# EAGLE design 00A-34 (EAGLE 6.3)
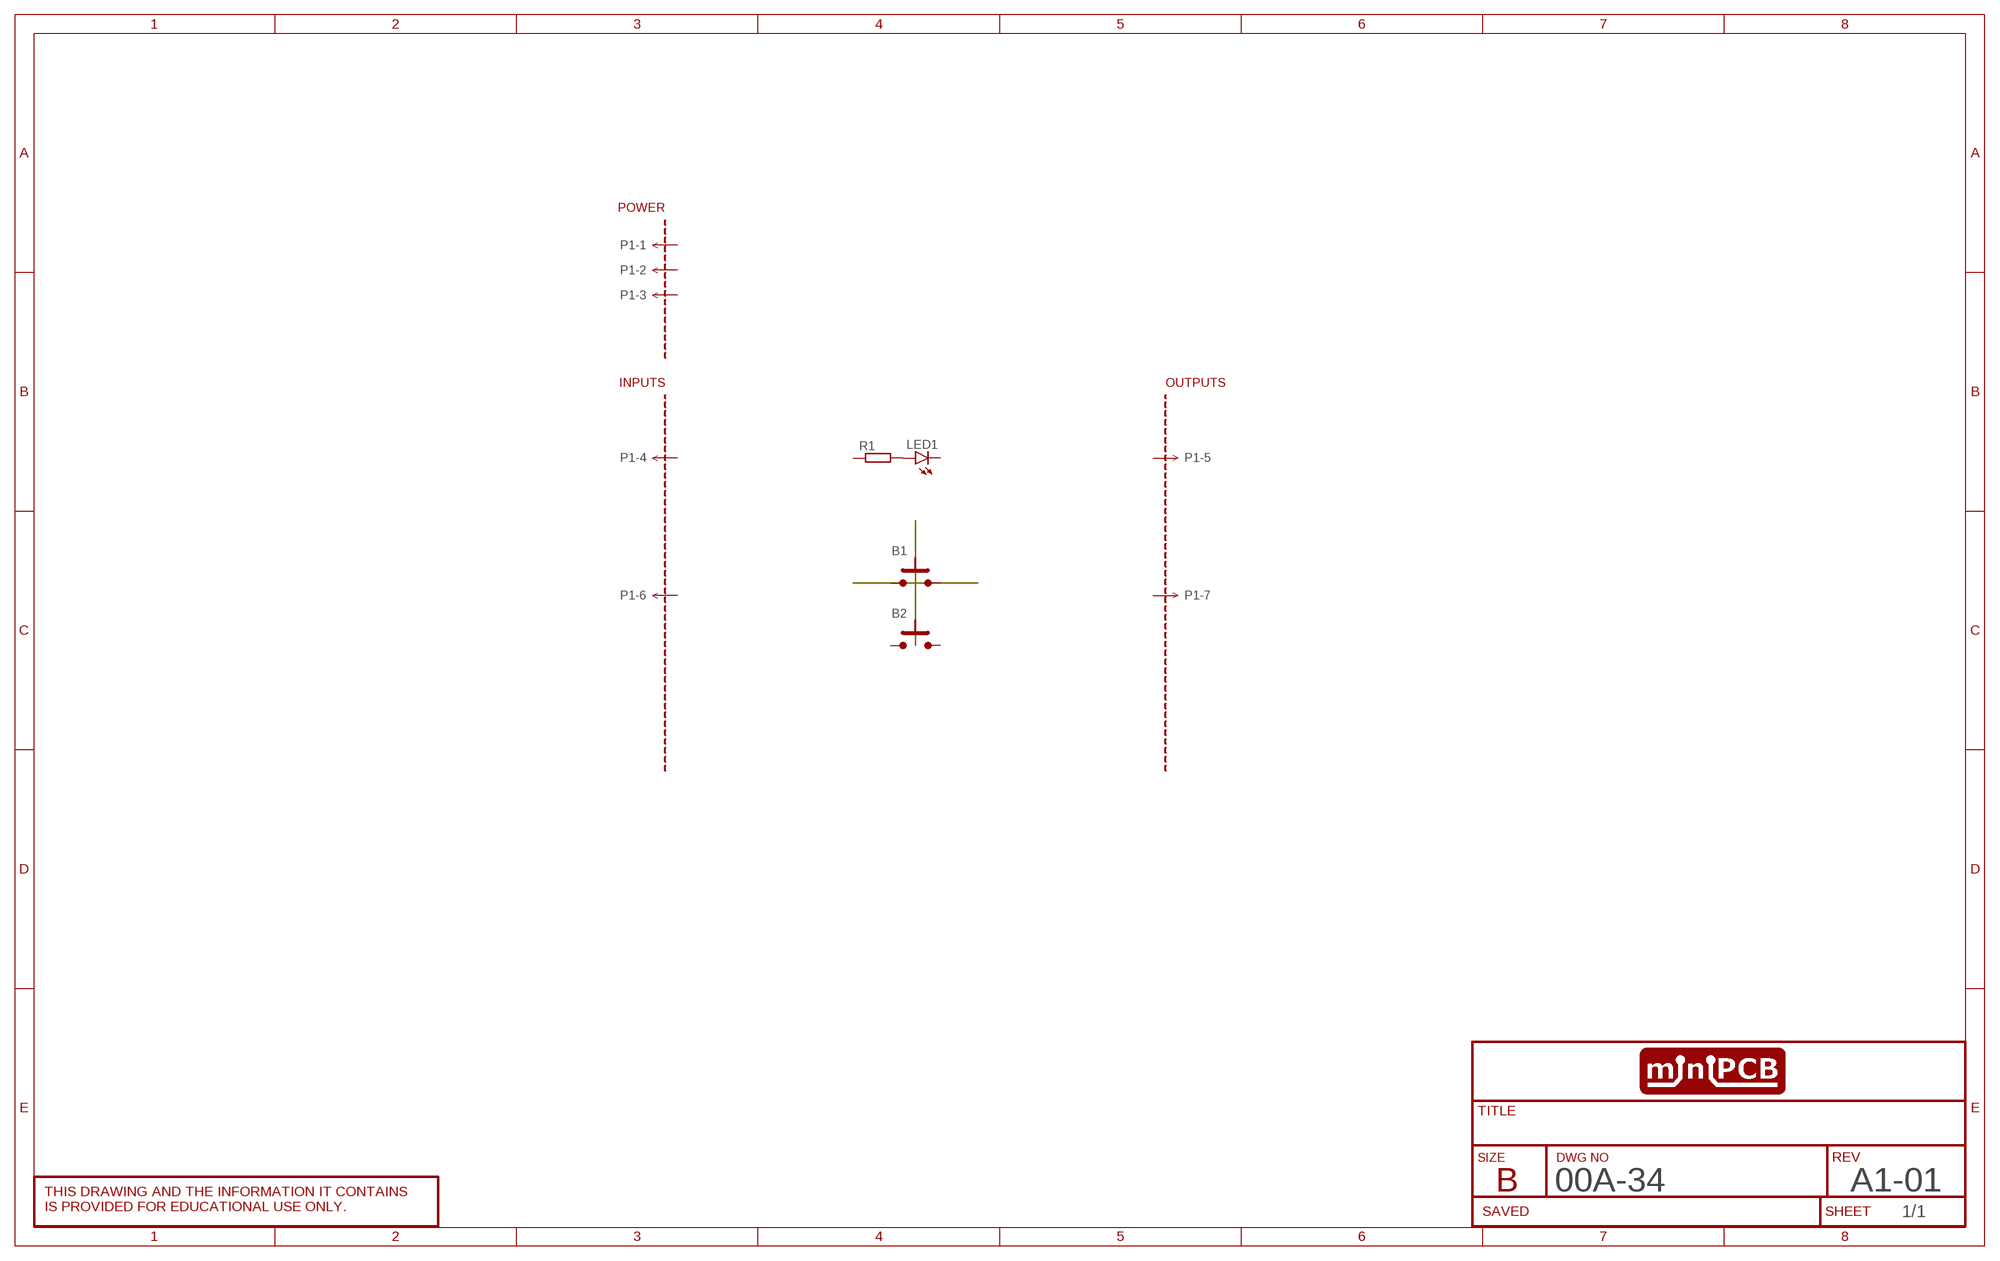
[diagram p0: schematic, sheet 1]
SHEET1 (SCHEMATIC): REV: A1-01

## Parts
B1  PUSHBUTTON6X6MM  [6X6MM]
B2  PUSHBUTTON6X6MM  [6X6MM]
LED1  LED5MM  [LED5MM]
P1  MINIPCB_7P  [PINS_1X7]
PCB1  MINIPCB_0P50X50  [MINIPCB_0P_50X50MM]
R1  RESISTORSMD  [R0805]

## Nets
N$239: LED1.A R1.2
Unconnected: B1.1.A B1.2.A B1.3.B B1.4.B B2.1.A B2.2.A B2.3.B B2.4.B LED1.K(C) P1.1 P1.2 P1.3 P1.4 P1.5 P1.6 P1.7 R1.1

## Library data of the parts
B1 B2 = minipcb:PUSHBUTTON: Tactile push button switch
LED1 = minipcb:LED: LED OSRAM: - CHIPLED LG R971, LG N971, LY N971, LG Q971, LY Q971, LO R971, LY R971 LH N974, LH R974 LS Q976, LO Q976, LY Q976 LO Q996 - Hyper CHIPLED LW Q18S LB Q993, LB Q99A, LB R99A - SideLED LS A670, LO A670, LY A670, LG A670, LP A670 LB A673, LV A673, LT A673, LW A673 LH A674 LY A675 LS A676, LA A676, LO A676, LY A676, LW A676 LS A679, LY A679, LG A679 - Hyper Micro SIDELED® LS Y876, LA Y876, LO Y876, LY Y876 LT Y87S - SmartLED LW L88C, LW L88S LB L89C, LB L89S, LG L890 LS L89K, LO L89K, LY L89K LS L896, LA L896, LO L896, LY L896 - TOPLED LS T670, LO T670, LY T670, LG T670, LP T670 LSG T670, LSP T670, LSY T670, LOP T670, LYG T670 LG T671, LOG T671, LSG T671 LB T673, LV T673, LT T673, LW T673 LH T674 LS T676, LA T676, LO T676, LY T676, LB T676, LH T676, LSB T676, LW T676 LB T67C, LV T67C, LT T67C, LS T67K, LO T67K, LY T67K, LW E67C LS E67B, LA E67B, LO E67B, LY E67B, LB E67C, LV E67C, LT E67C LW T67C LS T679, LY T679, LG T679 LS T770, LO T770, LY T770, LG T770, LP T770 LB T773, LV T773, LT T773, LW T773 LH T774 LS E675, LA E675, LY E675, LS T675 LS T776, LA T776, LO T776, LY T776, LB T776 LHGB T686 LT T68C, LB T68C - Hyper Mini TOPLED® LB M676 - Mini TOPLED Santana® LG M470 LS M47K, LO M47K, LY M47K Source: http://www.osram.convergy.de LUXEON: - LUMILED® LXK2-PW12-R00, LXK2-PW12-S00, LXK2-PW14-U00, LXK2-PW14-V00 LXK2-PM12-R00, LXK2-PM12-S00, LXK2-PM14-U00 LXK2-PE12-Q00, LXK2-PE12-R00, LXK2-PE12-S00, LXK2-PE14-T00, LXK2-PE14-U00 LXK2-PB12-K00, LXK2-PB12-L00, LXK2-PB12-M00, LXK2-PB14-N00, LXK2-PB14-P00, LXK2-PB14-Q00 LXK2-PR12-L00, LXK2-PR12-M00, LXK2-PR14-Q00, LXK2-PR14-R00 LXK2-PD12-Q00, LXK2-PD12-R00, LXK2-PD12-S00 LXK2-PH12-R00, LXK2-PH12-S00 LXK2-PL12-P00, LXK2-PL12-Q00, LXK2-PL12-R00 Source: www.luxeon.com KINGBRIGHT: KA-3528ASYC Source: www.kingbright.com
P1 = minipcb:MINIPCB_7P
PCB1 = minipcb:MINIPCB_0P; CIRCUIT_CATEGORY: PROBE AND PROTOTYPING; PART_NUMBER: 00A-34; REVISION: A1-01; TITLE: 50x50mm PROTOBOARD
R1 = minipcb:RESISTOR

## Board
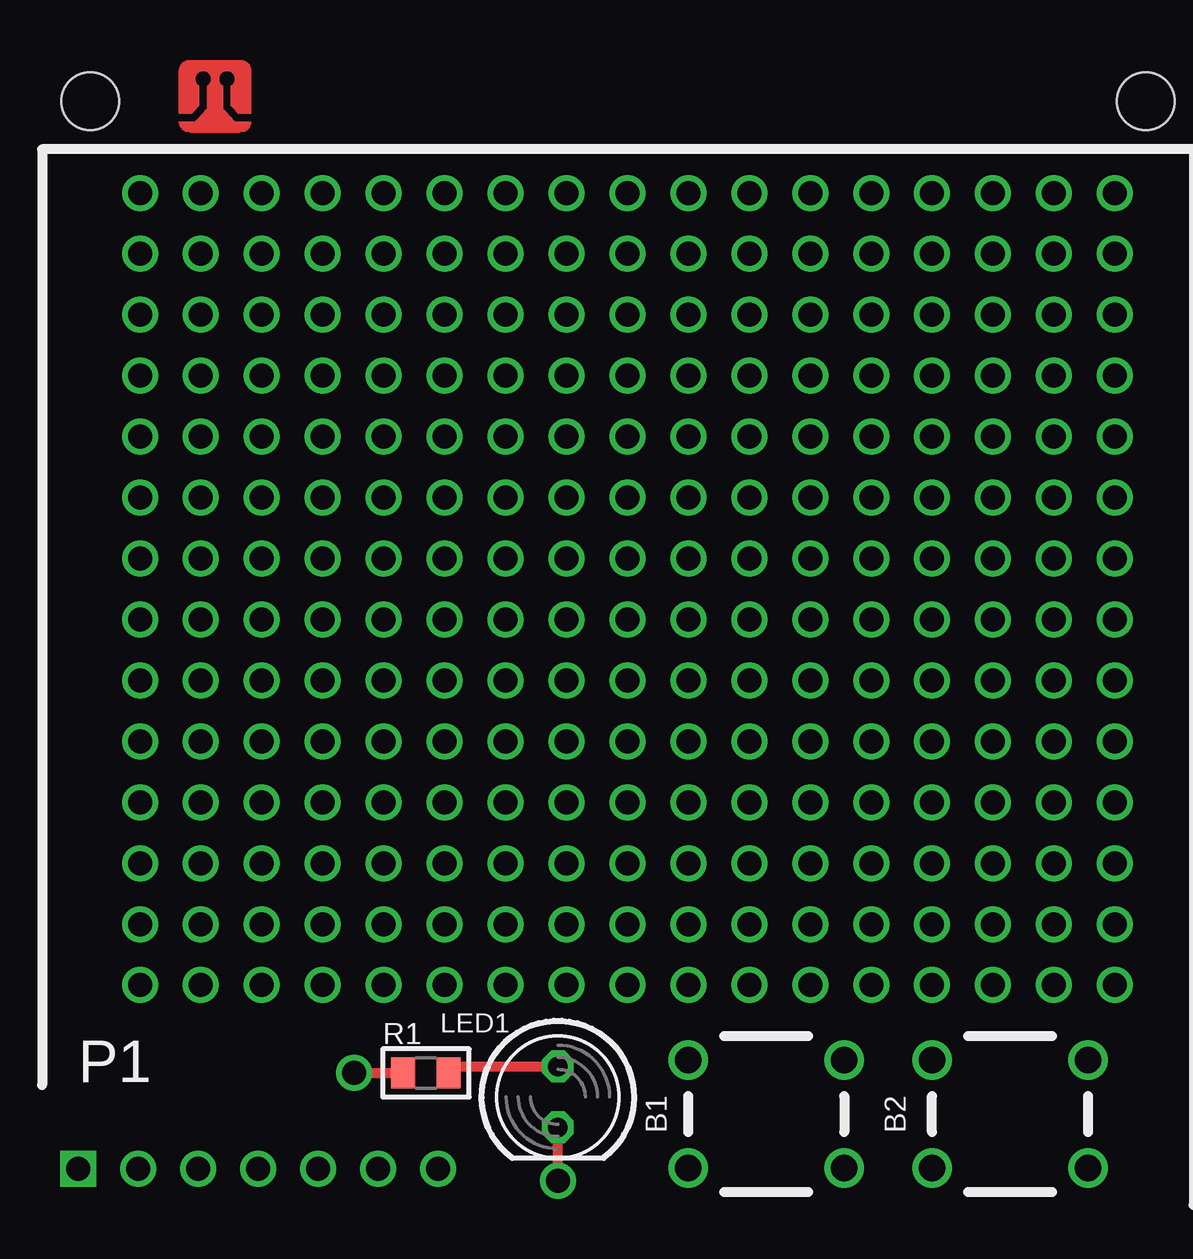
[diagram p1: board, top side]
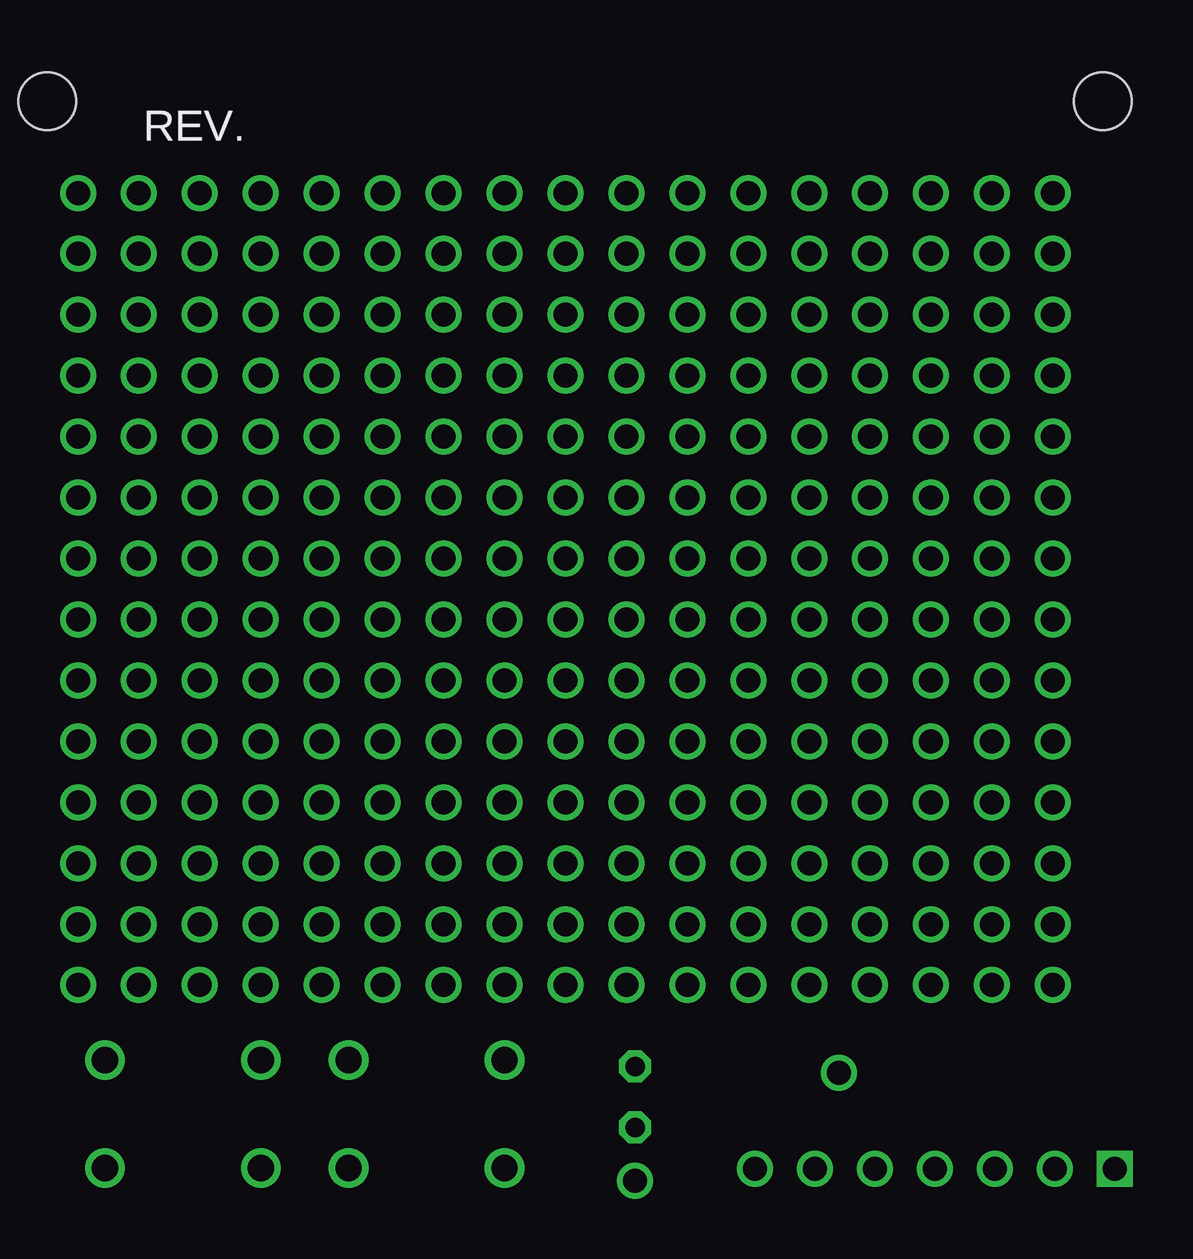
[diagram p2: board, bottom side, seen from below]

No outline drawn. Coordinates in mm, seen from the top.
Copper layers (1*16): Top 0.035mm / dielectric 1.5mm / Bottom 0.035mm
Design rules "default": minimum track width 10mil, minimum drill 0.6mm, track to track 8mil, track to pad 8mil, pad to pad 8mil, via to via 8mil, smd to smd 8mil, copper to edge 40mil, drill to drill 8mil, minimum pad ring 10mil, minimum via ring 8mil, stop-mask expansion 4mil, vias tented up to drill 0mil, thermal gap 10mil

### Footprints (pad centres in the part's own frame; a part is rotated, then mirrored left to right if it is on the bottom)
6X6MM = drill 1.1: 1.A 0,0; 2.A 6.5,0; 3.B 0,4.5; 4.B 6.5,4.5
LED5MM = drill 0.813 octagon: A -1.27,0; K 1.27,0
PINS_1X7 = drill 1 square: 1 0,0 | drill 1: 2 2.5,0; 3 5,0; 4 7.5,0; 5 10,0; 6 12.5,0; 7 15,0
MINIPCB_0P_50X50MM = hole 2.4: 47,47; 3,47
R0805 = smd 1 x 1.3: 1 -0.95,0; 2 0.95,0

### Placement (x,y rotation side)
B1  27.94,2.54 0 top
B2  38.1,2.54 0 top
LED1  22.5,5.5 270 top
P1  2.5,2.5 0 top
PCB1  0,0 0 top
R1  17,6.5 0 top

### Tracks (layer width: path | path; a pad name or v marks a point on that pad's centre or on a via)
N$1  (via drill 1)
  other vias: 5.08,10.16
N$2  (via drill 1)
  other vias: 5.08,12.7
N$3  (via drill 1)
  other vias: 7.62,10.16
N$4  (via drill 1)
  other vias: 10.16,10.16
N$5  (via drill 1)
  other vias: 7.62,12.7
N$6  (via drill 1)
  other vias: 10.16,12.7
N$7  (via drill 1)
  other vias: 12.7,12.7
N$8  (via drill 1)
  other vias: 12.7,10.16
N$9  (via drill 1)
  Top 0.406: v22.5,2 22.5,4 | v14,6.5 16,6.5
  other vias: 15.24,10.16
N$10  (via drill 1)
  other vias: 15.24,12.7
N$11  (via drill 1)
  other vias: 20.32,12.7
N$12  (via drill 1)
  other vias: 17.78,12.7
N$13  (via drill 1)
  other vias: 17.78,10.16
N$14  (via drill 1)
  other vias: 20.32,10.16
N$15  (via drill 1)
  other vias: 22.86,12.7
N$16  (via drill 1)
  other vias: 22.86,10.16
N$17  (via drill 1)
  other vias: 25.4,12.7
N$18  (via drill 1)
  other vias: 25.4,10.16
N$19  (via drill 1)
  other vias: 27.94,12.7
N$20  (via drill 1)
  other vias: 27.94,10.16
N$21  (via drill 1)
  other vias: 30.48,12.7
N$22  (via drill 1)
  other vias: 30.48,10.16
N$23  (via drill 1)
  other vias: 33.02,12.7
N$24  (via drill 1)
  other vias: 33.02,10.16
N$25  (via drill 1)
  other vias: 35.56,12.7
N$26  (via drill 1)
  other vias: 38.1,10.16
N$27  (via drill 1)
  other vias: 35.56,10.16
N$28  (via drill 1)
  other vias: 38.1,12.7
N$29  (via drill 1)
  other vias: 40.64,12.7
N$30  (via drill 1)
  other vias: 40.64,10.16
N$31  (via drill 1)
  other vias: 43.18,12.7
N$32  (via drill 1)
  other vias: 43.18,10.16
N$33  (via drill 1)
  other vias: 45.72,12.7
N$34  (via drill 1)
  other vias: 45.72,10.16
N$35  (via drill 1)
  other vias: 5.08,15.24
N$36  (via drill 1)
  other vias: 5.08,17.78
N$37  (via drill 1)
  other vias: 7.62,15.24
N$38  (via drill 1)
  other vias: 10.16,15.24
N$39  (via drill 1)
  other vias: 7.62,17.78
N$40  (via drill 1)
  other vias: 10.16,17.78
N$41  (via drill 1)
  other vias: 12.7,17.78
N$42  (via drill 1)
  other vias: 12.7,15.24
N$43  (via drill 1)
  other vias: 15.24,15.24
N$44  (via drill 1)
  other vias: 15.24,17.78
N$45  (via drill 1)
  other vias: 20.32,17.78
N$46  (via drill 1)
  other vias: 17.78,17.78
N$47  (via drill 1)
  other vias: 17.78,15.24
N$48  (via drill 1)
  other vias: 20.32,15.24
N$49  (via drill 1)
  other vias: 22.86,17.78
N$50  (via drill 1)
  other vias: 22.86,15.24
N$51  (via drill 1)
  other vias: 25.4,17.78
N$52  (via drill 1)
  other vias: 25.4,15.24
N$53  (via drill 1)
  other vias: 27.94,17.78
N$54  (via drill 1)
  other vias: 27.94,15.24
N$55  (via drill 1)
  other vias: 30.48,17.78
N$56  (via drill 1)
  other vias: 30.48,15.24
N$57  (via drill 1)
  other vias: 33.02,17.78
N$58  (via drill 1)
  other vias: 33.02,15.24
N$59  (via drill 1)
  other vias: 35.56,17.78
N$60  (via drill 1)
  other vias: 38.1,15.24
N$61  (via drill 1)
  other vias: 35.56,15.24
N$62  (via drill 1)
  other vias: 38.1,17.78
N$63  (via drill 1)
  other vias: 40.64,17.78
N$64  (via drill 1)
  other vias: 40.64,15.24
N$65  (via drill 1)
  other vias: 43.18,17.78
N$66  (via drill 1)
  other vias: 43.18,15.24
N$67  (via drill 1)
  other vias: 45.72,17.78
N$68  (via drill 1)
  other vias: 45.72,15.24
N$69  (via drill 1)
  other vias: 5.08,20.32
N$70  (via drill 1)
  other vias: 5.08,22.86
N$71  (via drill 1)
  other vias: 7.62,20.32
N$72  (via drill 1)
  other vias: 10.16,20.32
N$73  (via drill 1)
  other vias: 7.62,22.86
N$74  (via drill 1)
  other vias: 10.16,22.86
N$75  (via drill 1)
  other vias: 12.7,22.86
N$76  (via drill 1)
  other vias: 12.7,20.32
N$77  (via drill 1)
  other vias: 15.24,20.32
N$78  (via drill 1)
  other vias: 15.24,22.86
N$79  (via drill 1)
  other vias: 20.32,22.86
N$80  (via drill 1)
  other vias: 17.78,22.86
N$81  (via drill 1)
  other vias: 17.78,20.32
N$82  (via drill 1)
  other vias: 20.32,20.32
N$83  (via drill 1)
  other vias: 22.86,22.86
N$84  (via drill 1)
  other vias: 22.86,20.32
N$85  (via drill 1)
  other vias: 25.4,22.86
N$86  (via drill 1)
  other vias: 25.4,20.32
N$87  (via drill 1)
  other vias: 27.94,22.86
N$88  (via drill 1)
  other vias: 27.94,20.32
N$89  (via drill 1)
  other vias: 30.48,22.86
N$90  (via drill 1)
  other vias: 30.48,20.32
N$91  (via drill 1)
  other vias: 33.02,22.86
N$92  (via drill 1)
  other vias: 33.02,20.32
N$93  (via drill 1)
  other vias: 35.56,22.86
N$94  (via drill 1)
  other vias: 38.1,20.32
N$95  (via drill 1)
  other vias: 35.56,20.32
N$96  (via drill 1)
  other vias: 38.1,22.86
N$97  (via drill 1)
  other vias: 40.64,22.86
N$98  (via drill 1)
  other vias: 40.64,20.32
N$99  (via drill 1)
  other vias: 43.18,22.86
N$100  (via drill 1)
  other vias: 43.18,20.32
N$101  (via drill 1)
  other vias: 45.72,22.86
N$102  (via drill 1)
  other vias: 45.72,20.32
N$103  (via drill 1)
  other vias: 5.08,25.4
N$104  (via drill 1)
  other vias: 5.08,27.94
N$105  (via drill 1)
  other vias: 7.62,25.4
N$106  (via drill 1)
  other vias: 10.16,25.4
N$107  (via drill 1)
  other vias: 7.62,27.94
N$108  (via drill 1)
  other vias: 10.16,27.94
N$109  (via drill 1)
  other vias: 12.7,27.94
N$110  (via drill 1)
  other vias: 12.7,25.4
N$111  (via drill 1)
  other vias: 15.24,25.4
N$112  (via drill 1)
  other vias: 15.24,27.94
N$113  (via drill 1)
  other vias: 20.32,27.94
N$114  (via drill 1)
  other vias: 17.78,27.94
N$115  (via drill 1)
  other vias: 17.78,25.4
N$116  (via drill 1)
  other vias: 20.32,25.4
N$117  (via drill 1)
  other vias: 22.86,27.94
N$118  (via drill 1)
  other vias: 22.86,25.4
N$119  (via drill 1)
  other vias: 25.4,27.94
N$120  (via drill 1)
  other vias: 25.4,25.4
N$121  (via drill 1)
  other vias: 27.94,27.94
N$122  (via drill 1)
  other vias: 27.94,25.4
N$123  (via drill 1)
  other vias: 30.48,27.94
N$124  (via drill 1)
  other vias: 30.48,25.4
N$125  (via drill 1)
  other vias: 33.02,27.94
N$126  (via drill 1)
  other vias: 33.02,25.4
N$127  (via drill 1)
  other vias: 35.56,27.94
N$128  (via drill 1)
  other vias: 38.1,25.4
N$129  (via drill 1)
  other vias: 35.56,25.4
N$130  (via drill 1)
  other vias: 38.1,27.94
N$131  (via drill 1)
  other vias: 40.64,27.94
N$132  (via drill 1)
  other vias: 40.64,25.4
N$133  (via drill 1)
  other vias: 43.18,27.94
N$134  (via drill 1)
  other vias: 43.18,25.4
N$135  (via drill 1)
  other vias: 45.72,27.94
N$136  (via drill 1)
  other vias: 45.72,25.4
N$137  (via drill 1)
  other vias: 5.08,30.48
N$138  (via drill 1)
  other vias: 5.08,33.02
N$139  (via drill 1)
  other vias: 7.62,30.48
N$140  (via drill 1)
  other vias: 10.16,30.48
N$141  (via drill 1)
  other vias: 7.62,33.02
N$142  (via drill 1)
  other vias: 10.16,33.02
N$143  (via drill 1)
  other vias: 12.7,33.02
N$144  (via drill 1)
  other vias: 12.7,30.48
N$145  (via drill 1)
  other vias: 15.24,30.48
N$146  (via drill 1)
  other vias: 15.24,33.02
N$147  (via drill 1)
  other vias: 20.32,33.02
N$148  (via drill 1)
  other vias: 17.78,33.02
N$149  (via drill 1)
  other vias: 17.78,30.48
N$150  (via drill 1)
  other vias: 20.32,30.48
N$151  (via drill 1)
  other vias: 22.86,33.02
N$152  (via drill 1)
  other vias: 22.86,30.48
N$153  (via drill 1)
  other vias: 25.4,33.02
N$154  (via drill 1)
  other vias: 25.4,30.48
N$155  (via drill 1)
  other vias: 27.94,33.02
N$156  (via drill 1)
  other vias: 27.94,30.48
N$157  (via drill 1)
  other vias: 30.48,33.02
N$158  (via drill 1)
  other vias: 30.48,30.48
N$159  (via drill 1)
  other vias: 33.02,33.02
N$160  (via drill 1)
  other vias: 33.02,30.48
N$161  (via drill 1)
  other vias: 35.56,33.02
N$162  (via drill 1)
  other vias: 38.1,30.48
N$163  (via drill 1)
  other vias: 35.56,30.48
N$164  (via drill 1)
  other vias: 38.1,33.02
N$165  (via drill 1)
  other vias: 40.64,33.02
N$166  (via drill 1)
  other vias: 40.64,30.48
N$167  (via drill 1)
  other vias: 43.18,33.02
N$168  (via drill 1)
  other vias: 43.18,30.48
N$169  (via drill 1)
  other vias: 45.72,33.02
N$170  (via drill 1)
  other vias: 45.72,30.48
N$171  (via drill 1)
  other vias: 5.08,35.56
N$172  (via drill 1)
  other vias: 5.08,38.1
N$173  (via drill 1)
  other vias: 7.62,35.56
N$174  (via drill 1)
  other vias: 10.16,35.56
N$175  (via drill 1)
  other vias: 7.62,38.1
N$176  (via drill 1)
  other vias: 10.16,38.1
N$177  (via drill 1)
  other vias: 12.7,38.1
N$178  (via drill 1)
  other vias: 12.7,35.56
N$179  (via drill 1)
  other vias: 15.24,35.56
N$180  (via drill 1)
  other vias: 15.24,38.1
N$181  (via drill 1)
  other vias: 20.32,38.1
N$182  (via drill 1)
  other vias: 17.78,38.1
N$183  (via drill 1)
  other vias: 17.78,35.56
N$184  (via drill 1)
  other vias: 20.32,35.56
N$185  (via drill 1)
  other vias: 22.86,38.1
N$186  (via drill 1)
  other vias: 22.86,35.56
N$187  (via drill 1)
  other vias: 25.4,38.1
N$188  (via drill 1)
  other vias: 25.4,35.56
N$189  (via drill 1)
  other vias: 27.94,38.1
N$190  (via drill 1)
  other vias: 27.94,35.56
N$191  (via drill 1)
  other vias: 30.48,38.1
N$192  (via drill 1)
  other vias: 30.48,35.56
N$193  (via drill 1)
  other vias: 33.02,38.1
N$194  (via drill 1)
  other vias: 33.02,35.56
N$195  (via drill 1)
  other vias: 35.56,38.1
N$196  (via drill 1)
  other vias: 38.1,35.56
N$197  (via drill 1)
  other vias: 35.56,35.56
N$198  (via drill 1)
  other vias: 38.1,38.1
N$199  (via drill 1)
  other vias: 40.64,38.1
N$200  (via drill 1)
  other vias: 40.64,35.56
N$201  (via drill 1)
  other vias: 43.18,38.1
N$202  (via drill 1)
  other vias: 43.18,35.56
N$203  (via drill 1)
  other vias: 45.72,38.1
N$204  (via drill 1)
  other vias: 45.72,35.56
N$205  (via drill 1)
  other vias: 5.08,40.64
N$206  (via drill 1)
  other vias: 5.08,43.18
N$207  (via drill 1)
  other vias: 7.62,40.64
N$208  (via drill 1)
  other vias: 10.16,40.64
N$209  (via drill 1)
  other vias: 7.62,43.18
N$210  (via drill 1)
  other vias: 10.16,43.18
N$211  (via drill 1)
  other vias: 12.7,43.18
N$212  (via drill 1)
  other vias: 12.7,40.64
N$213  (via drill 1)
  other vias: 15.24,40.64
N$214  (via drill 1)
  other vias: 15.24,43.18
N$215  (via drill 1)
  other vias: 20.32,43.18
N$216  (via drill 1)
  other vias: 17.78,43.18
N$217  (via drill 1)
  other vias: 17.78,40.64
N$218  (via drill 1)
  other vias: 20.32,40.64
N$219  (via drill 1)
  other vias: 22.86,43.18
N$220  (via drill 1)
  other vias: 22.86,40.64
N$221  (via drill 1)
  other vias: 25.4,43.18
N$222  (via drill 1)
  other vias: 25.4,40.64
N$223  (via drill 1)
  other vias: 27.94,43.18
N$224  (via drill 1)
  other vias: 27.94,40.64
N$225  (via drill 1)
  other vias: 30.48,43.18
N$226  (via drill 1)
  other vias: 30.48,40.64
N$227  (via drill 1)
  other vias: 33.02,43.18
N$228  (via drill 1)
  other vias: 33.02,40.64
N$229  (via drill 1)
  other vias: 35.56,43.18
N$230  (via drill 1)
  other vias: 38.1,40.64
N$231  (via drill 1)
  other vias: 35.56,40.64
N$232  (via drill 1)
  other vias: 38.1,43.18
N$233  (via drill 1)
  other vias: 40.64,43.18
N$234  (via drill 1)
  other vias: 40.64,40.64
N$235  (via drill 1)
  other vias: 43.18,43.18
N$236  (via drill 1)
  other vias: 43.18,40.64
N$237  (via drill 1)
  other vias: 45.72,43.18
N$238  (via drill 1)
  other vias: 45.72,40.64
N$239
  Top 0.406: R1.2 18.22,6.77 LED1.A